# EAGLE design mobileProg_SD (EAGLE 5.11)
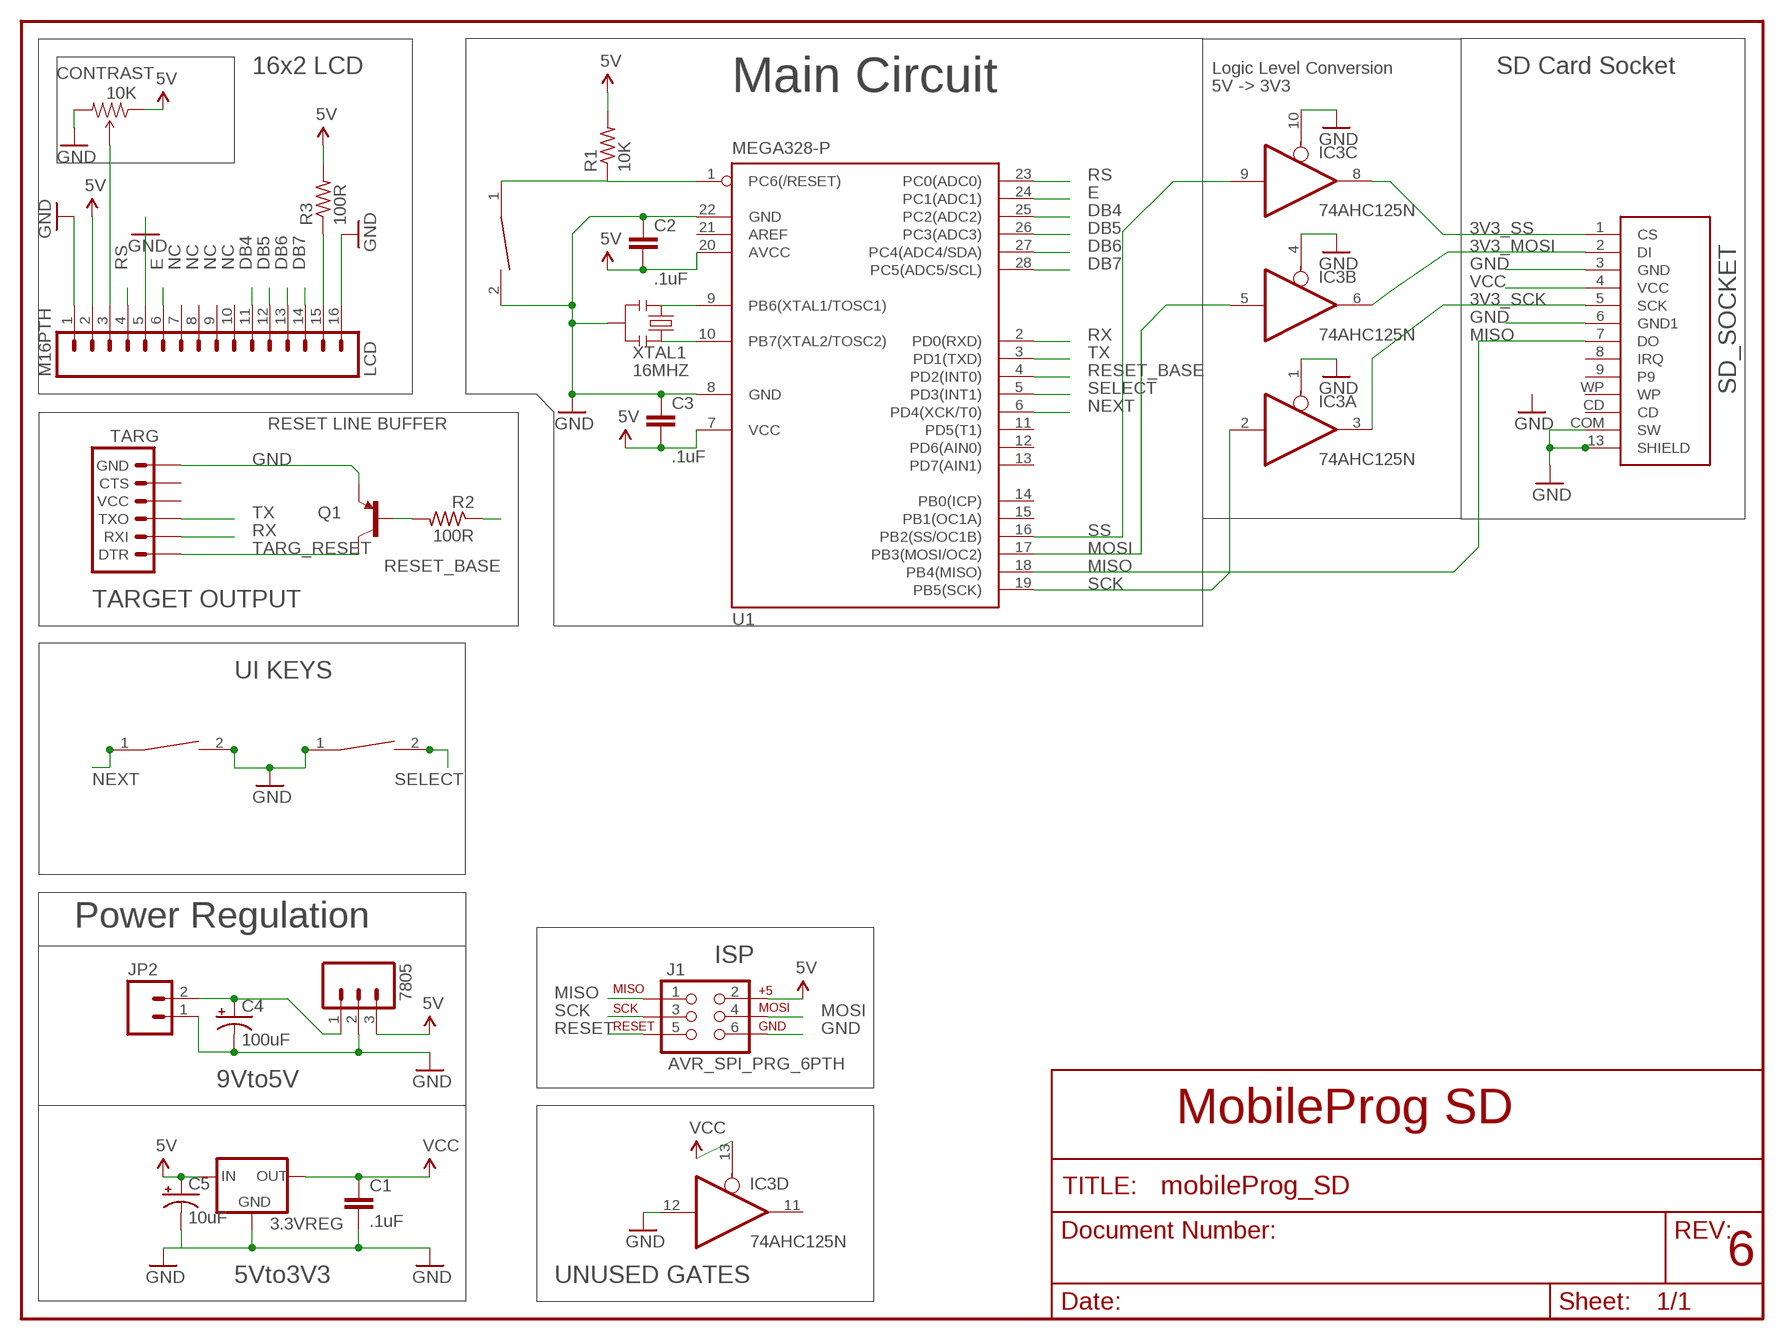
[diagram p0: schematic, sheet 1]

## Parts
3.3VREG  MCP1700INLINE  [TO92-INLINE]
7805  M03PTH  [1X03]
C1  .1uF  CAPPTH2  [CAP-PTH-SMALL2]
C2  .1uF  CAPPTH2  [CAP-PTH-SMALL2]
C3  .1uF  CAPPTH2  [CAP-PTH-SMALL2]
C4  100uF  CAP_POLPTH1  [CPOL-RADIAL-100UF-25V]
C5  10uF  CAP_POLPTH2  [CPOL-RADIAL-10UF-25V]
CONTRAST  10K  TRIMPOTPTH  [TRIM_POT_PTH]
IC3  74AHC125N  74125N  [DIL14]
J1  AVR_SPI_PRG_6PTH  [2X3]
JP2  M02POLAR  [MOLEX-1X2]
LCD  M16PTH  [1X16]
NEXT  TACT_TL1107  [TACT_TL1107]
Q1  TRANSISTOR_PNPTO92  [TO-92]
R1  10K  R-US_0207/10  [0207/10]
R2  100R  R-US_0207/10  [0207/10]
R3  100R  R-US_0207/10  [0207/10]
RESET_SWITCH  TACT_TL1107  [TACT_TL1107]
SD_SOCKET  SD_CARD_SOCKETSD  [SD-MMC_SOCKET-PP]
SELECT  TACT_TL1107  [TACT_TL1107]
TARG  ARDUINO_SERIAL_PROGRAMPTH  [1X06]
U1  MEGA328-P  MEGA8-P  [DIL28-3]
XTAL1  16MHZ  RESONATORPTH  [RESONATOR-PTH]

## Nets
3V3_MOSI: IC3.6(B:O) SD_SOCKET.2(DI)
3V3_SCK: IC3.3(A:O) SD_SOCKET.5(SCK)
3V3_SS: IC3.8(C:O) SD_SOCKET.1(CS)
5V: 3.3VREG.2(IN) 7805.3 C2.2 C3.2 C5.1(+) CONTRAST.1(CCW) J1.2 LCD.2 R1.2 R3.2 U1.7(VCC) U1.20(AVCC)
BKL: LCD.15 R3.1
CONTST: CONTRAST.2(WIPER) LCD.3
DB4: LCD.11 U1.25(PC2(ADC2))
DB5: LCD.12 U1.26(PC3(ADC3))
DB6: LCD.13 U1.27(PC4(ADC4/SDA))
DB7: LCD.14 U1.28(PC5(ADC5/SCL))
E: LCD.6 U1.24(PC1(ADC1))
GND: 3.3VREG.1(GND) 7805.2 C1.2 C2.1 C3.1 C4.2(-) C5.2(-) CONTRAST.3(CW) IC3.1(A:OE) IC3.4(B:OE) IC3.10(C:OE) IC3.12(D:I) J1.6 JP2.1 LCD.1 LCD.5 LCD.16 NEXT.2 Q1.1(E) RESET_SWITCH.2 SD_SOCKET.3(GND) SD_SOCKET.6(GND1) SD_SOCKET.13(SHIELD) SD_SOCKET.COM(SW) SELECT.1 TARG.6(GND) U1.8(GND) U1.22(GND) XTAL1.2
MISO: J1.1 SD_SOCKET.7(DO) U1.18(PB4(MISO))
MOSI: IC3.5(B:I) J1.4 U1.17(PB3(MOSI/OC2))
N$5: Q1.2(B) R2.2
N$8: U1.9(PB6(XTAL1/TOSC1)) XTAL1.1
N$9: U1.10(PB7(XTAL2/TOSC2)) XTAL1.3
NEXT: NEXT.1 U1.6(PD4(XCK/T0))
RESET: J1.5 R1.1 RESET_SWITCH.1 U1.1(PC6(/RESET))
RESET_BASE: R2.1 U1.4(PD2(INT0))
RS: LCD.4 U1.23(PC0(ADC0))
RX: TARG.2(RXI) U1.2(PD0(RXD))
SCK: IC3.2(A:I) J1.3 U1.19(PB5(SCK))
SELECT: SELECT.2 U1.5(PD3(INT1))
SS: IC3.9(C:I) U1.16(PB2(SS/OC1B))
TARG_RESET: Q1.3(C) TARG.1(DTR)
TX: TARG.3(TXO) U1.3(PD1(TXD))
VCC: 3.3VREG.3(OUT) C1.1 IC3.13(D:OE) SD_SOCKET.4(VCC)
VIN: 7805.1 C4.1(+) JP2.2
Unconnected: IC3.11(D:O) LCD.7 LCD.8 LCD.9 LCD.10 SD_SOCKET.8(IRQ) SD_SOCKET.9 SD_SOCKET.CD SD_SOCKET.WP TARG.4(VCC) TARG.5(CTS) U1.11(PD5(T1)) U1.12(PD6(AIN0)) U1.13(PD7(AIN1)) U1.14(PB0(ICP)) U1.15(PB1(OC1A)) U1.21(AREF)

## Notes on the sheet
- 16x2 LCD | Logic Level Conversion | SD Card Socket
- Main Circuit | 5V -> 3V3
- NC | NC | NC | NC
- SD_SOCKET
- RESET LINE BUFFER
- TARGET OUTPUT
- UI KEYS
- Power Regulation
- ISP
- 9Vto5V
- MobileProg SD
- 6
- 5Vto3V3 | UNUSED GATES

## Power pins joined to a net without a drawn wire
GND: IC3.7(P:GND)
VCC: IC3.14(P:VCC)

## Library data of the parts
3.3VREG = adafruit:MCP1700: VOLTAGE REGULATOR
7805 = SparkFun:M03: Header 3 Standard 3-pin 0.1" header. Use with straight break away headers (SKU : PRT-00116), right angle break away headers (PRT-00553), swiss pins (PRT-00743), machine pins (PRT-00117), and female headers (PRT-00115). Molex polarized connector foot print use with SKU : PRT-08232 with associated crimp pins and housings.
C1-C3 = SparkFun:CAP: Capacitor Standard 0603 ceramic capacitor, and 0.1" leaded capacitor.
C4 C5 = SparkFun:CAP_POL: Capacitor Polarized These are standard SMD and PTH capacitors. Normally 10uF, 47uF, and 100uF in electrolytic and tantalum varieties. Always verify the external diameter of the through hole cap, it varies with capacity, voltage, and manufacturer. The EIA devices should be standard.
CONTRAST = SparkFun:TRIMPOT
IC3 = 74xx-us:74*125: Quad bus BUFFER, 3-state
J1 = SparkFun:AVR_SPI_PRG_6: AVR ISP 6 Pin This is the reduced ISP connector for AVR programming. Common on Arduino. This footprint will take up less PCB space and can be used with a 10-pin to 6-pin adapter such as SKU: BOB-08508
JP2 = SparkFun:M02: Header 2 Standard 2-pin 0.1" header. Use with straight break away headers (SKU : PRT-00116), right angle break away headers (PRT-00553), swiss pins (PRT-00743), machine pins (PRT-00117), and female headers (PRT-00115). Molex polarized connector foot print use with SKU : PRT-08233 with associated crimp pins and housings.
LCD = SparkFun:M16
NEXT RESET_SWITCH SELECT = customswitch:TACT_TL1107: Tactile Switch, 2 pin, TL1107 http://search.digikey.com/scripts/DkSearch/dksus.dll?Detail&name=EG2513-ND
Q1 = SparkFun:TRANSISTOR_PNP
R1 R2 = resistor:R-US_: RESISTOR, American symbol
R3 = adafruit:R-US_: RESISTOR, American symbol
SD_SOCKET = customsparkfun:SD_CARD_SOCKET: SD/MMC Socket Media socket for SD and MMC cards. Push-push type. Schematic element and footprint production proven. Spark Fun Electronics SKU : PRT-00136
TARG = SparkFun:ARDUINO_SERIAL_PROGRAM
U1 = atmel:MEGA8-P: MICROCONTROLLER 8 Kbytes FLASH, 1 kbytes SRAM, 512 bytes EEPROM, USART, 4-channel 10 bit ADC, 2-channel 8 bit ADC Pin compatible with Atmega48, ATMega88, ATMega168 Source: avr.lbr
XTAL1 = SparkFun:RESONATOR: Resonator Small SMD resonator. This is the itty bitty 10/20MHz resonators with built in caps. CSTCE10M0G55 and CSTCE20M0V53. Footprint has been reviewed closely but hasn't been tested yet.

## Board
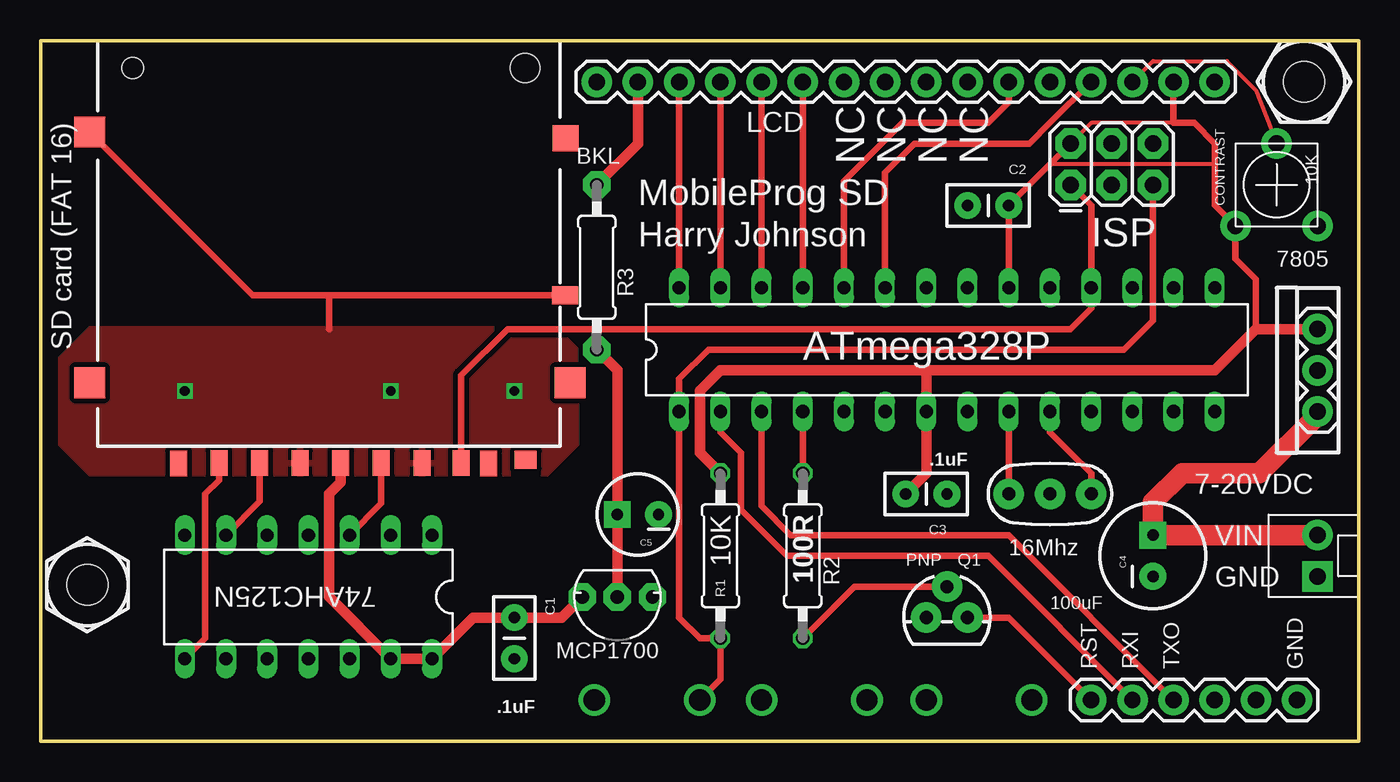
[diagram p1: board, top side]
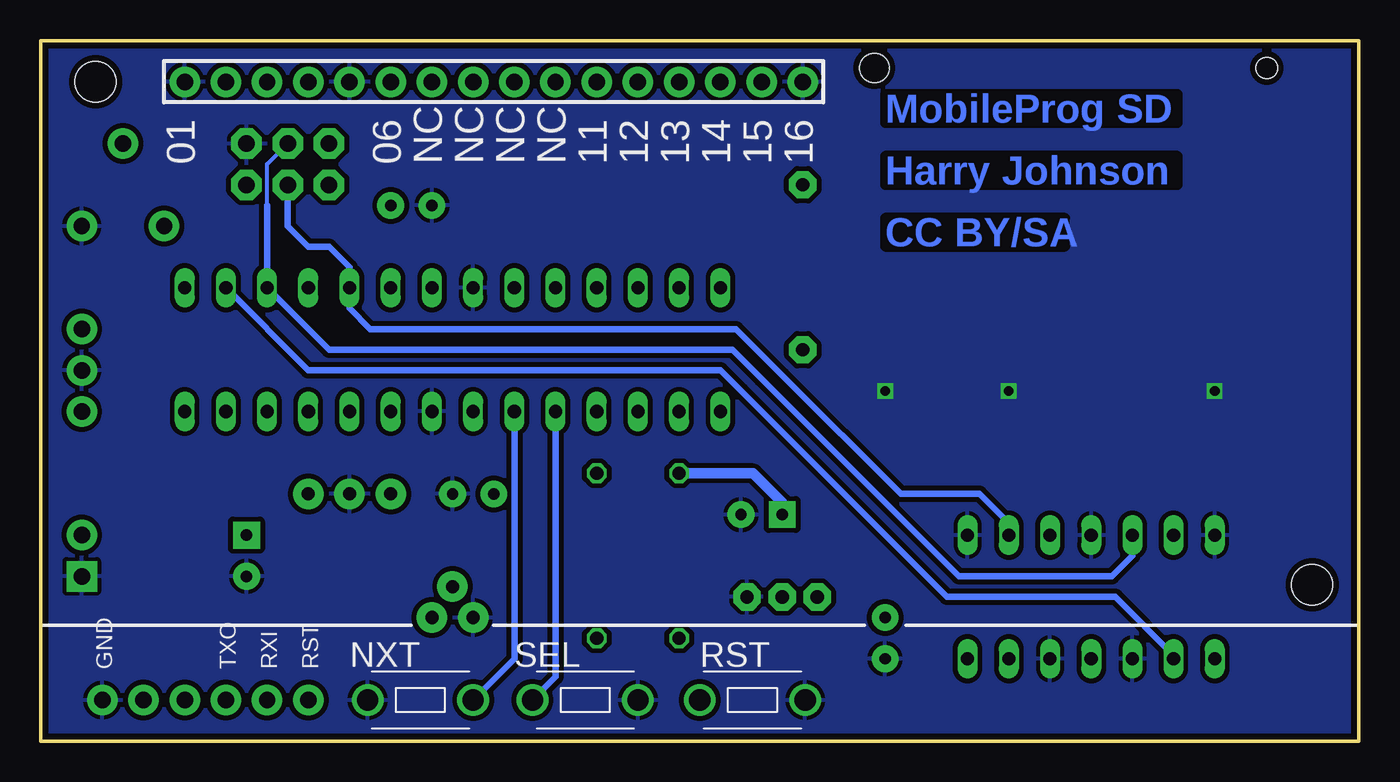
[diagram p2: board, bottom side, seen from below]

Size 81.28 x 43.18 mm. Coordinates in mm from the lower left corner, seen from the top.
Outline: 0,0 81.28,0 81.28,43.18 0,43.18 0,0
Copper layers (1*16): Top 0.0356mm / dielectric 1.5011mm / Bottom 0.0356mm
Design rules "LaenPCBOrder": minimum track width 6mil, minimum drill 13mil, track to track 6mil, track to pad 6mil, pad to pad 6mil, via to via 6mil, smd to smd 6mil, copper to edge 15mil, drill to drill 6mil, minimum pad ring 7mil, minimum via ring 7mil, stop-mask expansion 4mil, vias tented up to drill 0mil, thermal gap 10mil

### Footprints (pad centres in the part's own frame; a part is rotated, then mirrored left to right if it is on the bottom)
TO92-INLINE = drill 0.813 pad 1.676 octagon: 1 -2.159,0; 2 0,0; 3 2.159,0
1X03 = drill 1.016 pad 1.88 round: 1 0,0; 2 2.54,0; 3 5.08,0
CAP-PTH-SMALL2 = drill 0.7 pad 1.651 round: 1 0,0; 2 2.54,0
CPOL-RADIAL-100UF-25V = drill 0.7 pad 1.651 square: 1 1.27,0 | drill 0.7 pad 1.651 round: 2 -1.27,0
CPOL-RADIAL-10UF-25V = drill 0.7 pad 1.651 square: 1 1.27,0 | drill 0.7 pad 1.651 round: 2 -1.27,0
TRIM_POT_PTH = drill 1 pad 1.88 round: 1 -2.54,-2.54; 2 0,2.54; 3 2.54,-2.54
DIL14 = drill 0.813 long: 1 -7.62,-3.81; 2 -5.08,-3.81; 3 -2.54,-3.81; 4 0,-3.81; 5 2.54,-3.81; 6 5.08,-3.81; 7 7.62,-3.81; 8 7.62,3.81; 9 5.08,3.81; 10 2.54,3.81; 11 0,3.81; 12 -2.54,3.81; 13 -5.08,3.81; 14 -7.62,3.81
2X3 = drill 1.016 pad 1.88 octagon: 1 0,0; 2 0,2.54; 3 2.54,0; 4 2.54,2.54; 5 5.08,0; 6 5.08,2.54
MOLEX-1X2 = drill 1.016 pad 1.88 square: 1 0,0 | drill 1.016 pad 1.88 round: 2 2.54,0
1X16 = drill 1.016 pad 1.88 round: 1 0,0; 2 2.54,0; 3 5.08,0; 4 7.62,0; 5 10.16,0; 6 12.7,0; 7 15.24,0; 8 17.78,0; 9 20.32,0; 10 22.86,0; 11 25.4,0; 12 27.94,0; 13 30.48,0; 14 33.02,0; 15 35.56,0; 16 38.1,0
TACT_TL1107 = drill 1.3 round: 1 0,0; 2 6.5,0
TO-92 = drill 0.813 pad 1.88 round: 1 -1.27,0; 2 0,1.905; 3 1.27,0
0207/10 = drill 0.813 octagon: 1 -5.08,0; 2 5.08,0
0207/10' = drill 0.813 pad 1.676 octagon: 1 -5.08,0; 2 5.08,0
SD-MMC_SOCKET-PP = smd 1.05 x 1.56: 1 6.77,26.04; 2 4.27,26.04; 3 1.77,26.04; 4 -0.73,26.04; 5 -3.23,26.04; 6 -5.73,26.04; 7 -8.15,26.04; 8 -9.85,26.06; 9 9.27,26.06 | smd 1.9 x 1.9: 13 14.75,5.64; 14 -14.87,21.09; 15 14.75,21.09 | smd 1.35 x 1.1: CD -12.13,25.83 | smd 1.6 x 1.1: COM -14.55,15.69 | smd 1.6 x 1.6: WP -14.6,6.02 | hole 1.8: -12.1,1.69 | hole 1.3: 12.1,1.69
1X06 = drill 1.016 pad 1.88 round: 1 0,0; 2 2.54,0; 3 5.08,0; 4 7.62,0; 5 10.16,0; 6 12.7,0
DIL28-3 = drill 0.813 long: 1 -16.51,-3.81; 2 -13.97,-3.81; 3 -11.43,-3.81; 4 -8.89,-3.81; 5 -6.35,-3.81; 6 -3.81,-3.81; 7 -1.27,-3.81; 8 1.27,-3.81; 9 3.81,-3.81; 10 6.35,-3.81; 11 8.89,-3.81; 12 11.43,-3.81; 13 13.97,-3.81; 14 16.51,-3.81; 15 16.51,3.81; 16 13.97,3.81; 17 11.43,3.81; 18 8.89,3.81; 19 6.35,3.81; 20 3.81,3.81; 21 1.27,3.81; 22 -1.27,3.81; 23 -3.81,3.81; 24 -6.35,3.81; 25 -8.89,3.81; 26 -11.43,3.81; 27 -13.97,3.81; 28 -16.51,3.81
2.5MMSCREW = hole 2.5: 0,0
RESONATOR-PTH = drill 0.8 pad 1.88 round: 1 -2.54,0; 2 0,0; 3 2.54,0

### Placement (x,y rotation side)
3.3VREG  35.56,8.89 180 top
7805  78.74,20.32 90 top
C1  29.21,7.62 270 top
C2  57.15,33.02 0 top
C3  55.88,15.24 180 top
C4  68.58,11.43 90 top
C5  36.83,13.97 180 top
CONTRAST  76.2,34.29 0 top
IC3  16.51,8.89 180 top
J1  63.5,34.29 0 top
JP2  78.74,10.16 90 top
LCD  72.39,40.64 180 top
NEXT  54.61,2.54 180 bottom
Q1  55.88,7.62 0 top
R1  41.91,11.43 90 top
R2  46.99,11.43 270 top
R3  100R  [0207/10']  34.29,29.21 270 top
RESET_SWITCH  40.64,2.54 0 bottom
SD_SOCKET  17.78,43.18 180 top
SELECT  44.45,2.54 180 bottom
TARG  64.77,2.54 0 top
U1  55.88,24.13 0 top
U$8  [2.5MMSCREW]  2.89,9.64 0 top
U$9  [2.5MMSCREW]  77.89,40.64 30 top
XTAL1  62.23,15.24 0 top

### Tracks (layer width: path | path; a pad name or v marks a point on that pad's centre or on a via)
3V3_MOSI
  Top 0.406: IC3.6 13.51,14.78 SD_SOCKET.2
3V3_SCK
  Top 0.406: IC3.3 21.01,14.66 SD_SOCKET.5
3V3_SS
  Top 0.406: IC3.8 10.16,6.35 10.16,15.24 11.01,16.09 SD_SOCKET.1
5V
  Top 0.254: J1.2 64.77,38.1 69.85,38.1 | 72.39,35.56 62.23,35.56
  Top 0.406: 74.93,25.4 74.93,28.47 73.66,29.74 CONTRAST.1 72.39,33.02 72.39,35.56 72.39,36.83 71.12,38.1 69.85,38.1 LCD.2 | J1.2 62.23,35.56 C2.2 U1.20
  Top 0.635: R1.2 40.64,17.78 40.64,21.59 41.91,22.86 54.61,22.86 | 54.61,22.86 U1.7 54.61,16.51 C3.2 | 54.61,22.86 72.39,22.86 74.93,25.4 7805.3 | R3.2 35.56,22.86 C5.1 3.3VREG.2
  Bottom 0.635: C5.1 35.56,14.71 37.36,16.51 R1.2
BKL
  Top 0.635: R3.1 36.83,36.83 LCD.15
CONTST
  Top 0.254: CONTRAST.2 74.93,40.11 73.13,41.91 68.58,41.91 LCD.3
DB4
  Top 0.406: U1.25 LCD.11
DB5
  Top 0.406: U1.26 LCD.12
DB6
  Top 0.406: U1.27 LCD.13
DB7
  Top 0.406: U1.28 LCD.14
E
  Top 0.406: U1.24 49.53,34.51 53.12,38.1 58.42,38.1 59.69,39.37 LCD.6
GND  (via drill 0.6)
  Top 0.406: 17.78,27.49 17.78,25.4 | 17.78,27.49 SD_SOCKET.COM | 17.78,27.49 13.08,27.49 SD_SOCKET.13
  other vias: 8.89,21.59 21.59,21.59 29.21,21.59
  pour Bottom (isolate 0.305): 0,0 0,43.18 81.28,43.18 81.28,0
  pour Top (isolate 0.305): 3.07,25.4 1.27,23.6 1.27,18.31 3.07,16.51 31.22,16.51 33.02,18.31 33.02,24.13 31.75,25.4
MISO
  Top 0.406: J1.1 64.77,33.02 U1.18 64.77,26.67 63.5,25.4 28.79,25.4 25.93,22.54 SD_SOCKET.7
MOSI
  Bottom 0.254: 67.31,33.02 67.31,35.56 J1.4
  Bottom 0.406: IC3.5 13.97,11.43 15.24,10.16 24.66,10.16 36.83,22.33 38.63,24.13 63.5,24.13 U1.17 67.31,33.02
N$5
  Top 0.406: R2.2 50.16,9.53 Q1.2
N$8
  Top 0.406: XTAL1.1 U1.9
N$9
  Top 0.406: XTAL1.3 64.77,16.51 63.5,17.78 62.23,19.05 U1.10
NEXT
  Bottom 0.406: NEXT.1 52.07,5.08 U1.6
RESET
  Top 0.406: J1.5 68.58,25.93 66.78,24.13 41.17,24.13 39.37,22.33 U1.1 39.37,7.62 40.64,6.35 R1.1 41.91,3.81 RESET_SWITCH.1
RESET_BASE
  Top 0.406: R2.1 U1.4
RS
  Top 0.406: U1.23 52.07,35.03 53.87,36.83 60.96,36.83 62.23,38.1 LCD.4
RX
  Top 0.406: TARG.2 58.42,11.43 46.02,11.43 43.18,14.27 43.18,17.78 41.91,19.05 U1.2
SCK
  Bottom 0.406: J1.3 66.04,31.75 64.77,30.48 63.5,30.48 62.23,29.21 U1.19 62.23,26.67 60.96,25.4 38.4,25.4 35.56,22.56 28.24,15.24 23.39,15.24 21.59,13.44 IC3.2
SELECT
  Bottom 0.406: SELECT.2 49.53,3.96 U1.5
SS
  Bottom 0.406: IC3.9 11.43,5.3 15.02,8.89 25.4,8.89 38.1,21.59 39.37,22.86 64.77,22.86 U1.16
TARG_RESET
  Top 0.406: Q1.3 59.69,7.62 TARG.1
TX
  Top 0.406: U1.3 44.45,14.5 46.25,12.7 59.69,12.7 TARG.3
VCC
  Top 0.635: 3.3VREG.3 32.13,7.62 C1.1 26.67,7.62 IC3.14 IC3.13 17.78,8.89 17.78,15.24 18.51,15.97 SD_SOCKET.4
VIN
  Top 1.27: 7805.1 78.74,20.1 75.15,16.51 70.38,16.51 68.58,14.71 C4.1 JP2.2

### Text on the board
Bottom: MobileProg SD | Harry Johnson | CC BY/SA
tPlace: BKL | NC | NC | NC | NC | 10K | MobileProg SD | Harry Johnson | ISP | 7805 | SD card (FAT 16) | ATmega328P | 7-20VDC | VIN | PNP | 16Mhz | GND | MCP1700 | RST | RXI | TXO | GND
bPlace: 16 | 15 | 14 | 13 | 12 | 11 | NC | NC | NC | NC | 06 | 01 | RST | SEL | NXT | RST | RXI | TXO | GND